# Altium schematic sheet UC3843_Boost.SchDoc
size A4
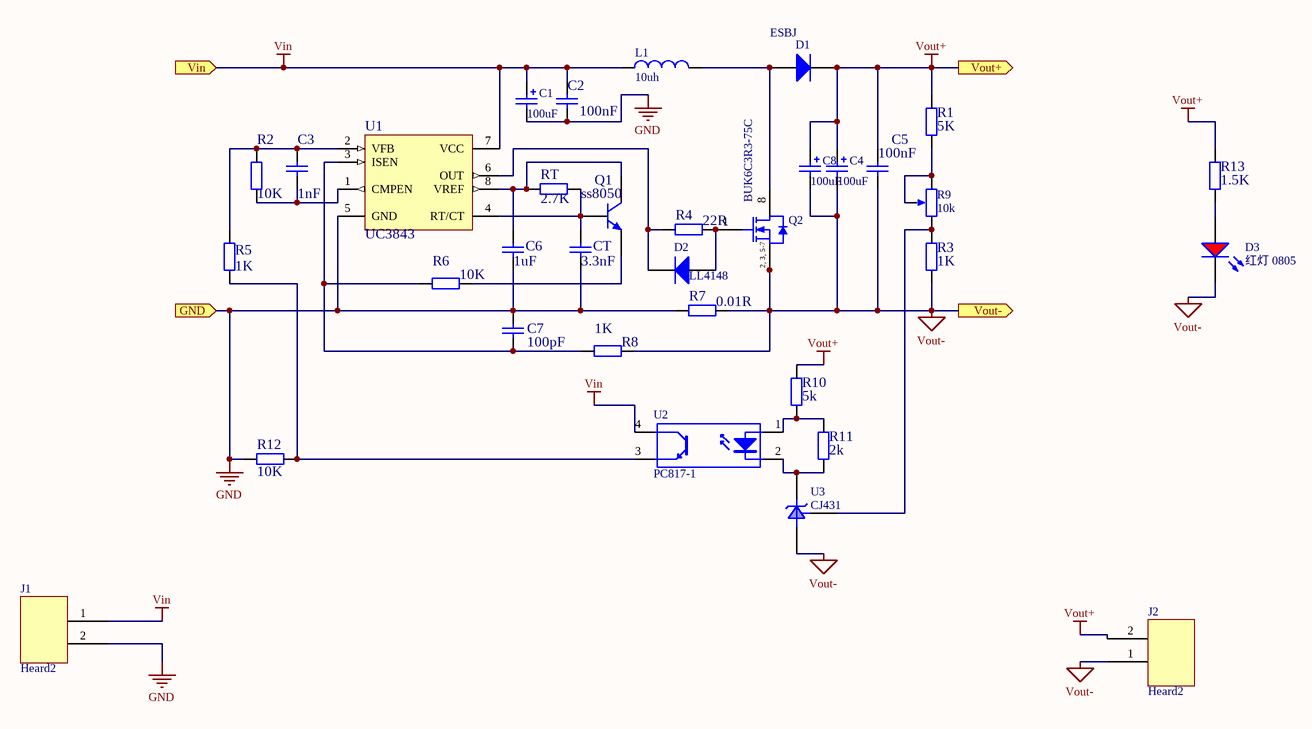
[diagram p0: UC3843_Boost.SchDoc]

## Parts
C1  100uF  [CASE-B_3528]
C2  100nF  [0805_C]
C3  1nF  [0805_C]
C4  100uF  [CASE-B_3528]
C5  100nF  [0805_C]
C6  1uF  [0805R]
C7  100pF  [0805R]
C8  100uF  [CASE-B_3528]
CT  3.3nF  [0805R]
D1  ESBJ  [SMC(DO-214AB)_S1]
D2  LL4148  [LL-34]
D3  红灯 0805  [0805_LED_S1]
J1  Heard2  [8.5端子]
J2  Heard2  [8.5端子]
L1  10uh  [L_10uh]
Q1  ss8050  [SOT-23(SOT-23-3)]
Q2  BUK6C3R3-75C  [NXP-SOT427_N]
R1  5K  [0805R]
R2  10K  [0805R]
R3  1K  [0805R]
R4  22R  [0805R]
R5  1K  [0805R]
R6  10K  [0805R]
R7  0.01R  [水泥电阻]
R8  1K  [0805R]
R9  10k  [电位器]
R10  5k  [0805R]
R11  2k  [0805R]
R12  10K  [0805R]
R13  1.5K  [0805R]
RT  2.7K  [0805R]
U1  UC3843  [SOIC-8_150mil]
U2  PC817-1  [LC-SMD-4]
U3  CJ431  [SOT-23(SOT-23-3)]

## Ports
GND (in), Vin (in), Vout+ (out), Vout- (out)

## Nets
GND: C1.2 C2.1 C6.2 C7.2 CT.2 J1.2 R7.2 R12.1 U1.5(GND) ; port GND
Vin: C1.1 C2.2 J1.1 L1.1 U1.7(VCC) U2.4(C) ; port Vin
Vout+: C4.1 C5.2 C8.1 D1.2(K) J2.2 R1.2 R10.2 R13.2 ; port Vout+
Vout-: C4.2 C5.1 C8.2 D3.K J2.1 Q2.2(S) Q2.3(S) Q2.5(S) Q2.6(S) Q2.7(S) R3.1 R7.1 R8.1 U3.3(A) ; port Vout-
NetC3_1: C3.1 R2.2 U1.1(CMPEN)
NetC3_2: C3.2 R2.1 R5.1 U1.2(VFB)
NetC6_1: C6.1 Q1.3(C) RT.1 U1.8(VREF)
NetC7_1: C7.1 R6.2 R8.2 U1.3(ISEN)
NetCT_1: CT.1 Q1.1(B) RT.2 U1.4(RT/CT)
NetD1_1: D1.1(A) L1.2 Q2.8(D)
NetD2_1: D2.1(A) Q2.1(G) R4.2
NetD2_2: D2.2(K) R4.1 U1.6(OUT)
NetD3_A: D3.A R13.1
NetQ1_2: Q1.2(E) R6.1
NetR1_1: R1.1 R9.2 R9.3
NetR3_2: R3.2 R9.1 U3.1(R)
NetR5_2: R5.2 R12.2 U2.3(E)
NetR10_1: R10.1 R11.2 U2.1(A)
NetR11_1: R11.1 U2.2(K) U3.2(K)

## Notes on the sheet
- (in symbol BUK6C3R3-75C,118) 2, 3, 5-7

## Library data of the parts
C1 C4 C8 = 3528 100uF (107) 10% 6.3V: 钽电容; ComponentLink1Description: 供应商链接; ComponentLink1URL: http://www.szlcsc.com/product/details_16815.html; Package: 3528; Supplier: LC; SuppliersPartNumber: C16133
C2 C3 C5 = 0805 100nF(104) 10% 50V: 贴片电容; ComponentLink1Description: 供应商链接; ComponentLink1URL: http://www.szlcsc.com/product/details_50686.html; Package: 0805; Supplier: LC; SuppliersPartNumber: C49678
C6 C7 CT = Cap: Capacitor; Published: 8-Jun-2000; LatestRevisionDate: 17-Jul-2002; LatestRevisionNote: Re-released for DXP Platform.; PackageReference: RAD-0.3; Publisher: Altium Limited; PackageDescription: Radial Cap, Thru-Hole; 2 Leads; 0.3 in Pin Spacing
  C6: Value: 1uF
  C7: Value: 100pF
  CT: Value: 3.3nF
D1 = SMC(DO-214AB) SS36-E3/57T: 二极管; ComponentLink1Description: 供应商链接; ComponentLink1URL: http://www.szlcsc.com/product/details_36698.html; Package: SMC(DO-214AB); Supplier: LC; SuppliersPartNumber: C35722
D2 = LL-34 LL4148 LL-34 1206: 开关二极管; ComponentLink1Description: 供应商链接; ComponentLink1URL: http://www.szlcsc.com/product/details_10338.html; Package: LL-34; Supplier: LC; SuppliersPartNumber: C9808
D3 = 0805 红灯: 发光二极管; ComponentLink1Description: 供应商链接; ComponentLink1URL: http://www.szlcsc.com/product/details_2668.html; Package: 0805; Supplier: LC; SuppliersPartNumber: C2295
J1 J2 = Header2
L1 = L_10uh_15A
Q1 = SOT-23 SS8050 Y1: 三极管; ComponentLink1Description: 供应商链接; ComponentLink1URL: http://www.szlcsc.com/product/details_2507.html; Package: SOT-23; Supplier: LC; SuppliersPartNumber: C2150
Q2 = BUK6C3R3-75C,118: N-Channel TrenchMOS Intermediate Level FET, 75 V, 181 A, 7-Pin SOT427, Tape and Reel; Manufacturer: NXP Semiconductors; Automotive Qualified: Y; Channel Type: N; ID [max] (A): 181; IDM [max] (A): 723; Packing: Tape & Reel; Qr [typ] (nC): 165; VDS [max] (V): 75; VGSth [typ] (V): 2.3; DatasheetVersion: Rev. 3; PackageVersion: 12-10-16, 10/2012; PackageReference: SOT427; PackageDescription: 7-Pin Plastic Single-ended Surface Mounted Package, Body 10 x 9.6 mm, Pitch 1.27 mm; Supplier 1: Digi-Key; Supplier Part Number 1: 568-9503-2-ND; Supplier 2: Digi-Key; Supplier Part Number 2: 568-9503-1-ND; Supplier 3: Digi-Key; Supplier Part Number 3: 568-9503-6-ND; Supplier 4: Mouser; Supplier Part Number 4: 771-BUK6C3R3-75C,118; Mounting Technology: Surface Mount; PartNumber: BUK6C3R3-75C,118; ComponentLink1Description: Manufacturer URL; ComponentLink1URL: http://www.nxp.com/; ComponentLink2Description: Datasheet; ComponentLink2URL: http://www.nxp.com/documents/data_sheet/BUK6C3R3-75C.pdf; ComponentLink3Description: Package Specification; ComponentLink3URL: http://www.nxp.com/documents/outline_drawing/sot427_po.pdf
R1-R8 R10-R13 RT = Res2: Resistor; Published: 8-Jun-2000; LatestRevisionDate: 17-Jul-2002; LatestRevisionNote: Re-released for DXP Platform.; PackageReference: AXIAL-0.4; Publisher: Altium Limited; PackageDescription: Axial Device, Thru-Hole; 2 Leads; 0.4 in Pin Spacing
  R1: Value: 5K
  R2 R6 R12: Value: 10K
  R3 R5 R8: Value: 1K
  R4: Value: 22R
  R7: Value: 0.01R
  R10: Value: 5k
  R11: Value: 2k
  R13: Value: 1.5K
  RT: Value: 2.7K
R9 = 滑动变阻器
U1 = UC3843BD1R2G_[C16414]: 开关电源; ComponentLink1Description: 供应商链接; ComponentLink1URL: http://www.szlcsc.com/product/details_17096.html; Package: SOIC-8_150mil; Supplier: LC; SuppliersPartNumber: C16414
U2 = TLP521
U3 = CJ431 0.5%431_[C3113]: 电压基准; ComponentLink1Description: 供应商链接; ComponentLink1URL: http://www.szlcsc.com/product/details_3500.html; Package: SOT-23; Supplier: LC; SuppliersPartNumber: C3113